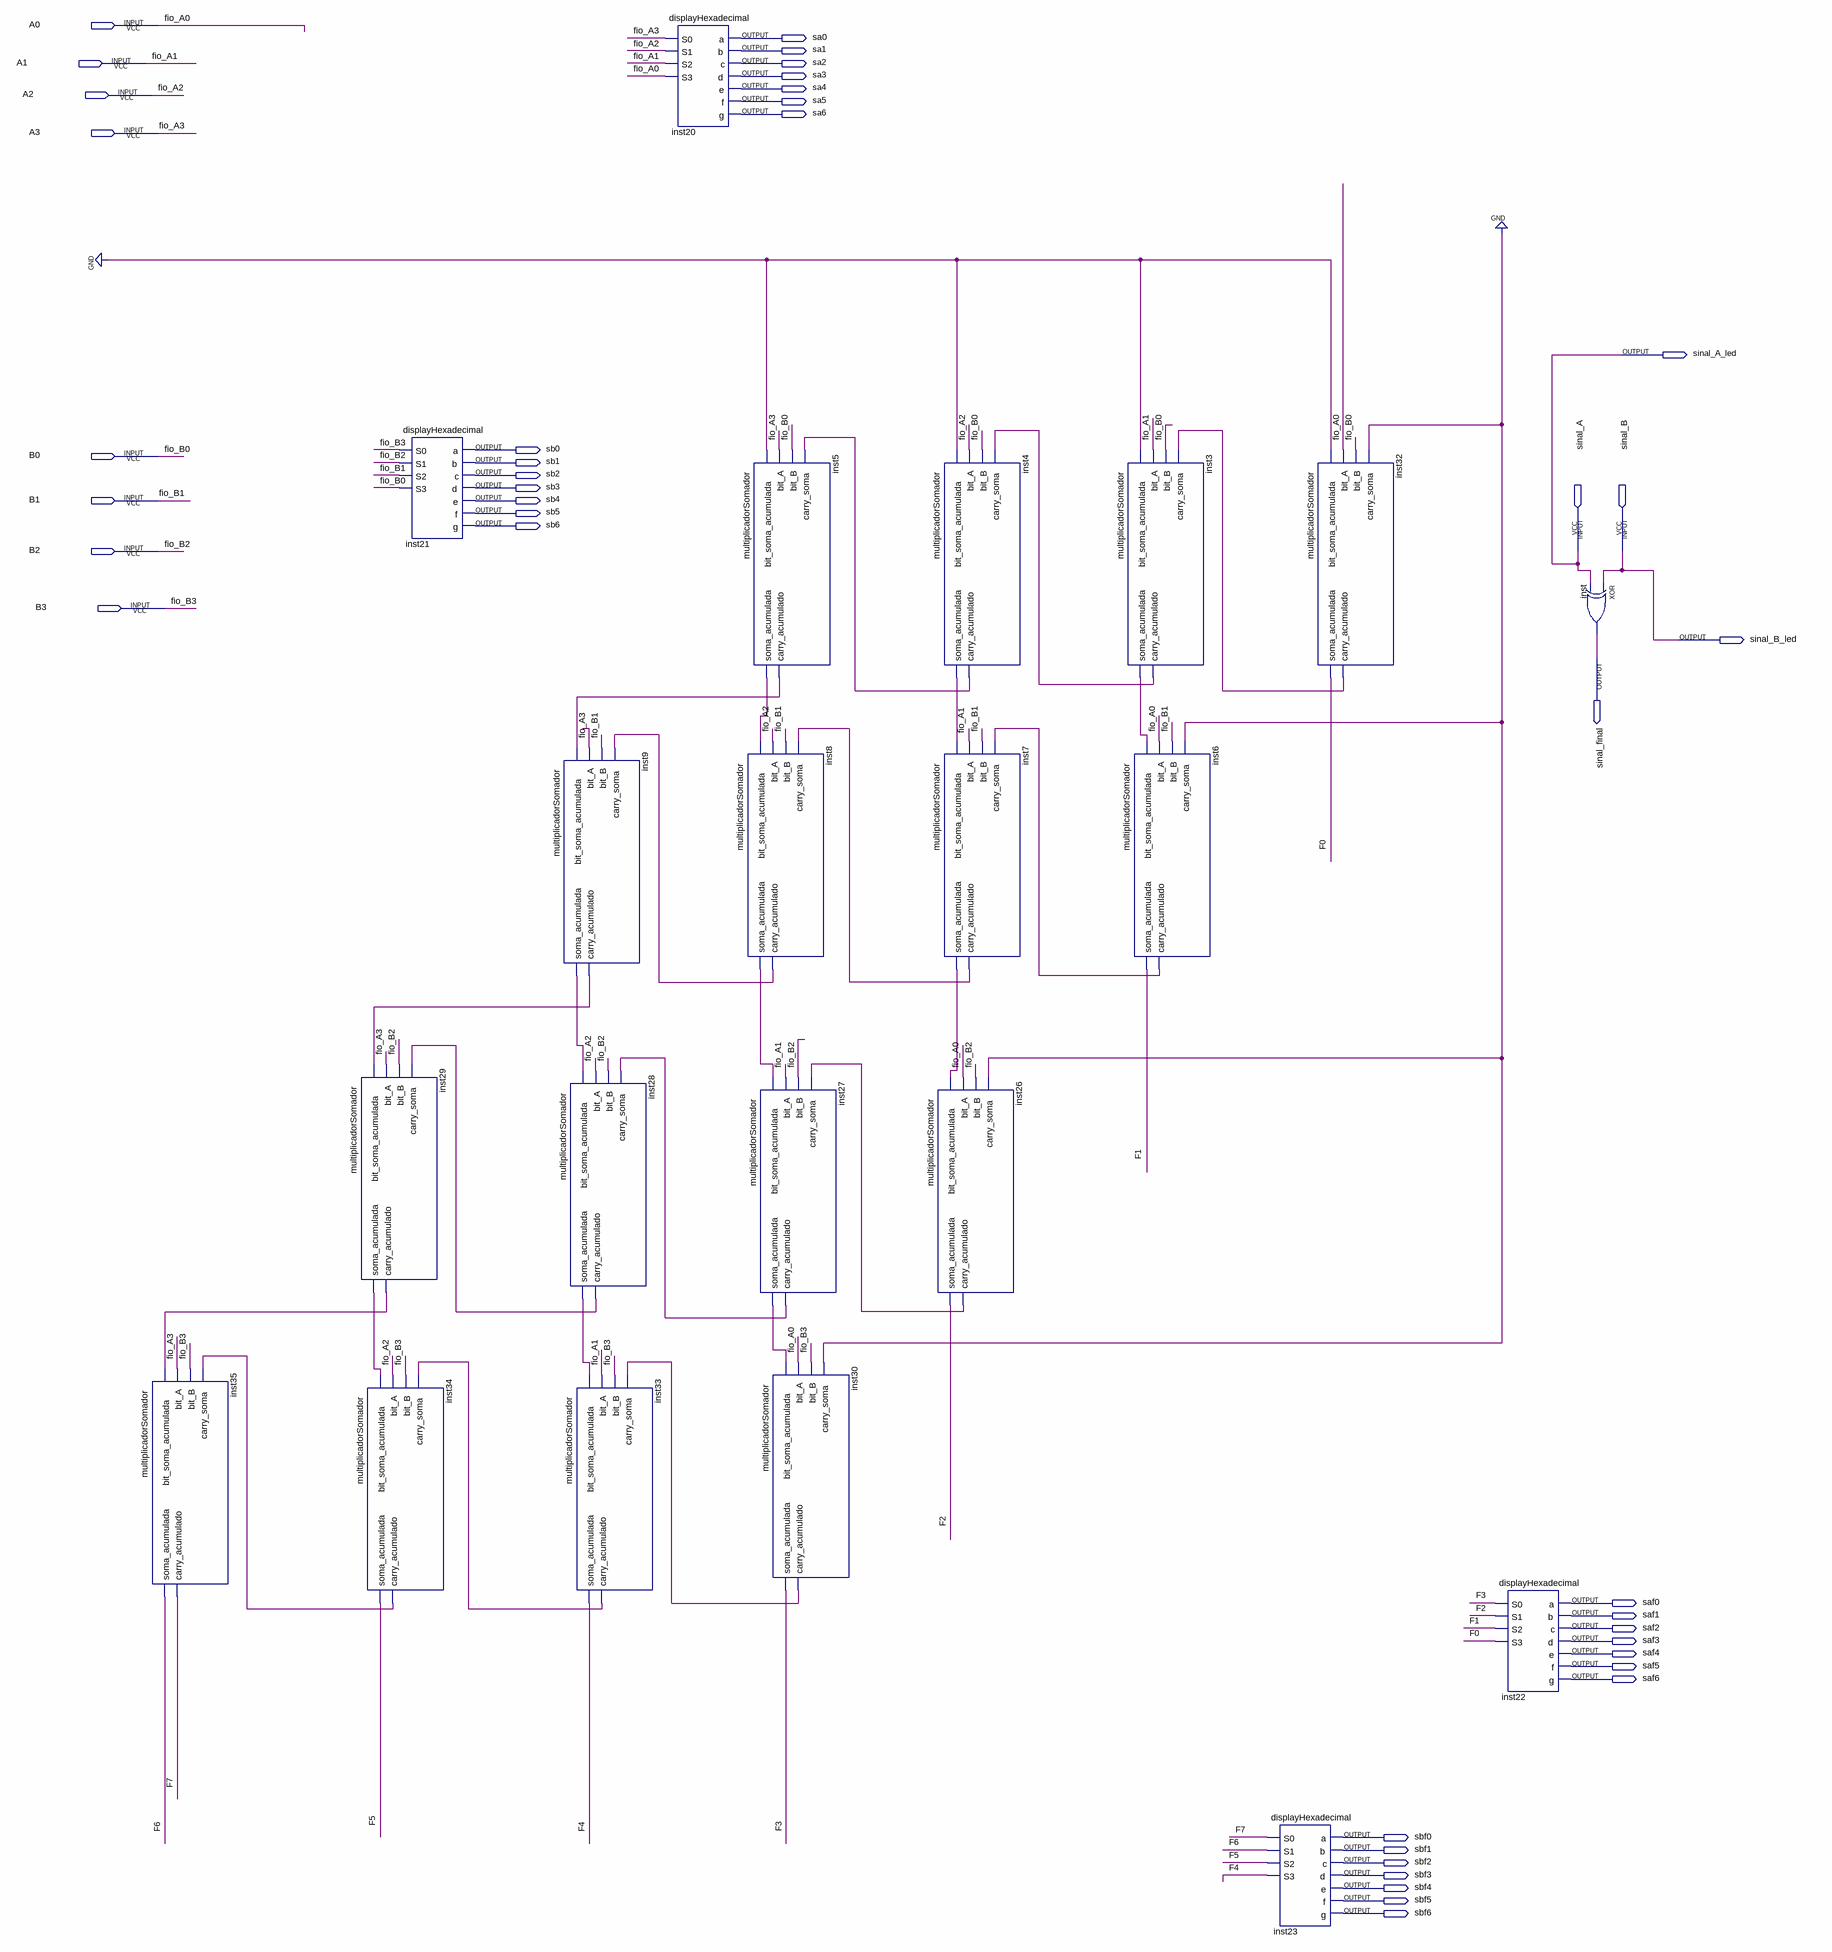
[diagram p0: schematic sheet]
// Quartus schematic aula10.bdf as structural Verilog: 21 symbols, 41 pins
module aula10 (
  input  A0,
  input  A1,
  input  A2,
  input  A3,
  input  B0,
  input  B1,
  input  B2,
  input  sinal_A,
  input  sinal_B,
  input  B3,
  output sa0,
  output sa1,
  output sa2,
  output sa3,
  output sa4,
  output sa5,
  output sa6,
  output sinal_A_led,
  output sb0,
  output sb1,
  output sb2,
  output sb3,
  output sb4,
  output sb5,
  output sb6,
  output sinal_B_led,
  output sinal_final,
  output saf0,
  output saf1,
  output saf2,
  output saf3,
  output saf4,
  output saf5,
  output saf6,
  output sbf0,
  output sbf1,
  output sbf2,
  output sbf3,
  output sbf4,
  output sbf5,
  output sbf6
);

  wire F0, F1, F2, F3, F4, F5, F6, F7, inst3_carry_acumulado, inst3_soma_acumulada, inst4_carry_acumulado,
       inst4_soma_acumulada, inst5_carry_acumulado, inst5_soma_acumulada, inst6_carry_acumulado,
       inst7_carry_acumulado, inst7_soma_acumulada, inst8_carry_acumulado, inst8_soma_acumulada,
       inst9_carry_acumulado, inst9_soma_acumulada, inst26_carry_acumulado, inst27_carry_acumulado,
       inst27_soma_acumulada, inst28_carry_acumulado, inst28_soma_acumulada, inst29_carry_acumulado,
       inst29_soma_acumulada, inst30_carry_acumulado, inst32_carry_acumulado, inst33_carry_acumulado,
       inst34_carry_acumulado;

  multiplicadorSomador inst35 (
    .bit_soma_acumulada(inst29_carry_acumulado), .bit_A(A3), .bit_B(B3), .carry_soma(inst34_carry_acumulado),
    .soma_acumulada(F6), .carry_acumulado(F7));
  multiplicadorSomador inst29 (
    .bit_soma_acumulada(inst9_carry_acumulado), .bit_A(A3), .bit_B(B2), .carry_soma(inst28_carry_acumulado),
    .soma_acumulada(inst29_soma_acumulada), .carry_acumulado(inst29_carry_acumulado));
  displayHexadecimal inst21 (
    .S0(B3), .S1(B2), .S2(B1), .S3(B0), .a(sb0), .b(sb1), .c(sb2), .d(sb3), .e(sb4), .f(sb5), .g(sb6));
  multiplicadorSomador inst34 (
    .bit_soma_acumulada(inst29_soma_acumulada), .bit_A(A2), .bit_B(B3), .carry_soma(inst33_carry_acumulado),
    .soma_acumulada(F5), .carry_acumulado(inst34_carry_acumulado));
  multiplicadorSomador inst9 (
    .bit_soma_acumulada(inst5_carry_acumulado), .bit_A(A3), .bit_B(B1), .carry_soma(inst8_carry_acumulado),
    .soma_acumulada(inst9_soma_acumulada), .carry_acumulado(inst9_carry_acumulado));
  multiplicadorSomador inst28 (
    .bit_soma_acumulada(inst9_soma_acumulada), .bit_A(A2), .bit_B(B2), .carry_soma(inst27_carry_acumulado),
    .soma_acumulada(inst28_soma_acumulada), .carry_acumulado(inst28_carry_acumulado));
  multiplicadorSomador inst33 (
    .bit_soma_acumulada(inst28_soma_acumulada), .bit_A(A1), .bit_B(B3), .carry_soma(inst30_carry_acumulado),
    .soma_acumulada(F4), .carry_acumulado(inst33_carry_acumulado));
  displayHexadecimal inst20 (
    .S0(A3), .S1(A2), .S2(A1), .S3(A0), .a(sa0), .b(sa1), .c(sa2), .d(sa3), .e(sa4), .f(sa5), .g(sa6));
  multiplicadorSomador inst5 (
    .bit_soma_acumulada(1'b0), .bit_A(A3), .bit_B(B0), .carry_soma(inst4_carry_acumulado),
    .soma_acumulada(inst5_soma_acumulada), .carry_acumulado(inst5_carry_acumulado));
  multiplicadorSomador inst8 (
    .bit_soma_acumulada(inst5_soma_acumulada), .bit_A(A2), .bit_B(B1), .carry_soma(inst7_carry_acumulado),
    .soma_acumulada(inst8_soma_acumulada), .carry_acumulado(inst8_carry_acumulado));
  multiplicadorSomador inst27 (
    .bit_soma_acumulada(inst8_soma_acumulada), .bit_A(A1), .bit_B(B2), .carry_soma(inst26_carry_acumulado),
    .soma_acumulada(inst27_soma_acumulada), .carry_acumulado(inst27_carry_acumulado));
  multiplicadorSomador inst30 (
    .bit_soma_acumulada(inst27_soma_acumulada), .bit_A(A0), .bit_B(B3), .carry_soma(1'b0),
    .soma_acumulada(F3), .carry_acumulado(inst30_carry_acumulado));
  multiplicadorSomador inst4 (
    .bit_soma_acumulada(1'b0), .bit_A(A2), .bit_B(B0), .carry_soma(inst3_carry_acumulado),
    .soma_acumulada(inst4_soma_acumulada), .carry_acumulado(inst4_carry_acumulado));
  multiplicadorSomador inst7 (
    .bit_soma_acumulada(inst4_soma_acumulada), .bit_A(A1), .bit_B(B1), .carry_soma(inst6_carry_acumulado),
    .soma_acumulada(inst7_soma_acumulada), .carry_acumulado(inst7_carry_acumulado));
  multiplicadorSomador inst26 (
    .bit_soma_acumulada(inst7_soma_acumulada), .bit_A(A0), .bit_B(B2), .carry_soma(1'b0),
    .soma_acumulada(F2), .carry_acumulado(inst26_carry_acumulado));
  multiplicadorSomador inst3 (
    .bit_soma_acumulada(1'b0), .bit_A(A1), .bit_B(B0), .carry_soma(inst32_carry_acumulado),
    .soma_acumulada(inst3_soma_acumulada), .carry_acumulado(inst3_carry_acumulado));
  multiplicadorSomador inst6 (
    .bit_soma_acumulada(inst3_soma_acumulada), .bit_A(A0), .bit_B(B1), .carry_soma(1'b0),
    .soma_acumulada(F1), .carry_acumulado(inst6_carry_acumulado));
  multiplicadorSomador inst32 (
    .bit_soma_acumulada(1'b0), .bit_A(A0), .bit_B(B0), .carry_soma(1'b0), .soma_acumulada(F0),
    .carry_acumulado(inst32_carry_acumulado));
  displayHexadecimal inst23 (
    .S0(F7), .S1(F6), .S2(F5), .S3(F4), .a(sbf0), .b(sbf1), .c(sbf2), .d(sbf3), .e(sbf4), .f(sbf5), .g(sbf6));
  displayHexadecimal inst22 (
    .S0(F3), .S1(F2), .S2(F1), .S3(F0), .a(saf0), .b(saf1), .c(saf2), .d(saf3), .e(saf4), .f(saf5), .g(saf6));
  xor inst (sinal_final, sinal_B, sinal_A);

  assign sinal_A_led = sinal_A;
  assign sinal_B_led = sinal_B;

  // Other names for the same wires on the sheet: fio_A0 = A0; fio_A1 = A1; fio_A2 = A2; fio_A3 = A3; fio_B0 = B0;
  //   fio_B1 = B1; fio_B2 = B2; fio_B3 = B3
endmodule
